# Altium project BridgeBoard.PrjPcb
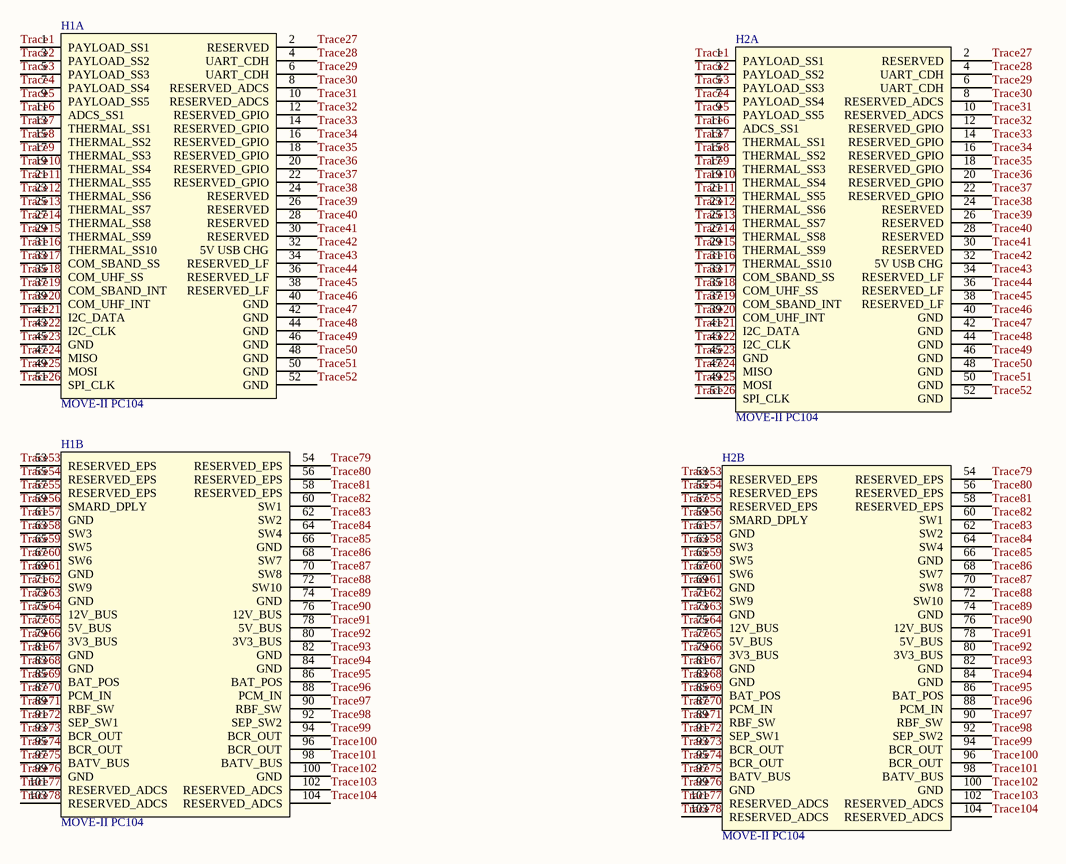
[diagram p0: BridgeBoard.SchDoc]
1 sheet, 2 parts. Net scope: global (net labels, ports and power ports of the same name join across sheets).
Board file: BridgeBoard.PcbDoc

## Sheet BridgeBoard.SchDoc
size A4

### Parts
H1  MOVE-II PC104  [PC104]  (parts A,B of 2)
H2  MOVE-II PC104  [PC104]  (parts A,B of 2)

### Nets
Trace1: H1.1(PAYLOAD_SS1) H2.1(PAYLOAD_SS1)
Trace2: H1.3(PAYLOAD_SS2) H2.3(PAYLOAD_SS2)
Trace3: H1.5(PAYLOAD_SS3) H2.5(PAYLOAD_SS3)
Trace4: H1.7(PAYLOAD_SS4) H2.7(PAYLOAD_SS4)
Trace5: H1.9(PAYLOAD_SS5) H2.9(PAYLOAD_SS5)
Trace6: H1.11(ADCS_SS1) H2.11(ADCS_SS1)
Trace7: H1.13(THERMAL_SS1) H2.13(THERMAL_SS1)
Trace8: H1.15(THERMAL_SS2) H2.15(THERMAL_SS2)
Trace9: H1.17(THERMAL_SS3) H2.17(THERMAL_SS3)
Trace10: H1.19(THERMAL_SS4) H2.19(THERMAL_SS4)
Trace11: H1.21(THERMAL_SS5) H2.21(THERMAL_SS5)
Trace12: H1.23(THERMAL_SS6) H2.23(THERMAL_SS6)
Trace13: H1.25(THERMAL_SS7) H2.25(THERMAL_SS7)
Trace14: H1.27(THERMAL_SS8) H2.27(THERMAL_SS8)
Trace15: H1.29(THERMAL_SS9) H2.29(THERMAL_SS9)
Trace16: H1.31(THERMAL_SS10) H2.31(THERMAL_SS10)
Trace17: H1.33(COM_SBAND_SS) H2.33(COM_SBAND_SS)
Trace18: H1.35(COM_UHF_SS) H2.35(COM_UHF_SS)
Trace19: H1.37(COM_SBAND_INT) H2.37(COM_SBAND_INT)
Trace20: H1.39(COM_UHF_INT) H2.39(COM_UHF_INT)
Trace21: H1.41(I2C_DATA) H2.41(I2C_DATA)
Trace22: H1.43(I2C_CLK) H2.43(I2C_CLK)
Trace23: H1.45(GND) H2.45(GND)
Trace24: H1.47(MISO) H2.47(MISO)
Trace25: H1.49(MOSI) H2.49(MOSI)
Trace26: H1.51(SPI_CLK) H2.51(SPI_CLK)
Trace27: H1.2(RESERVED) H2.2(RESERVED)
Trace28: H1.4(UART_CDH) H2.4(UART_CDH)
Trace29: H1.6(UART_CDH) H2.6(UART_CDH)
Trace30: H1.8(RESERVED_ADCS) H2.8(RESERVED_ADCS)
Trace31: H1.10(RESERVED_ADCS) H2.10(RESERVED_ADCS)
Trace32: H1.12(RESERVED_GPIO) H2.12(RESERVED_GPIO)
Trace33: H1.14(RESERVED_GPIO) H2.14(RESERVED_GPIO)
Trace34: H1.16(RESERVED_GPIO) H2.16(RESERVED_GPIO)
Trace35: H1.18(RESERVED_GPIO) H2.18(RESERVED_GPIO)
Trace36: H1.20(RESERVED_GPIO) H2.20(RESERVED_GPIO)
Trace37: H1.22(RESERVED_GPIO) H2.22(RESERVED_GPIO)
Trace38: H1.24(RESERVED) H2.24(RESERVED)
Trace39: H1.26(RESERVED) H2.26(RESERVED)
Trace40: H1.28(RESERVED) H2.28(RESERVED)
Trace41: H1.30(RESERVED) H2.30(RESERVED)
Trace42: H1.32(5V_USB_CHG) H2.32(5V_USB_CHG)
Trace43: H1.34(RESERVED_LF) H2.34(RESERVED_LF)
Trace44: H1.36(RESERVED_LF) H2.36(RESERVED_LF)
Trace45: H1.38(RESERVED_LF) H2.38(RESERVED_LF)
Trace46: H1.40(GND) H2.40(GND)
Trace47: H1.42(GND) H2.42(GND)
Trace48: H1.44(GND) H2.44(GND)
Trace49: H1.46(GND) H2.46(GND)
Trace50: H1.48(GND) H2.48(GND)
Trace51: H1.50(GND) H2.50(GND)
Trace52: H1.52(GND) H2.52(GND)
Trace53: H1.53(RESERVED_EPS) H2.53(RESERVED_EPS)
Trace54: H1.55(RESERVED_EPS) H2.55(RESERVED_EPS)
Trace55: H1.57(RESERVED_EPS) H2.57(RESERVED_EPS)
Trace56: H1.59(SMARD_DPLY) H2.59(SMARD_DPLY)
Trace57: H1.61(GND) H2.61(GND)
Trace58: H1.63(SW3) H2.63(SW3)
Trace59: H1.65(SW5) H2.65(SW5)
Trace60: H1.67(SW6) H2.67(SW6)
Trace61: H1.69(GND) H2.69(GND)
Trace62: H1.71(SW9) H2.71(SW9)
Trace63: H1.73(GND) H2.73(GND)
Trace64: H1.75(12V_BUS) H2.75(12V_BUS)
Trace65: H1.77(5V_BUS) H2.77(5V_BUS)
Trace66: H1.79(3V3_BUS) H2.79(3V3_BUS)
Trace67: H1.81(GND) H2.81(GND)
Trace68: H1.83(GND) H2.83(GND)
Trace69: H1.85(BAT_POS) H2.85(BAT_POS)
Trace70: H1.87(PCM_IN) H2.87(PCM_IN)
Trace71: H1.89(RBF_SW) H2.89(RBF_SW)
Trace72: H1.91(SEP_SW1) H2.91(SEP_SW1)
Trace73: H1.93(BCR_OUT) H2.93(BCR_OUT)
Trace74: H1.95(BCR_OUT) H2.95(BCR_OUT)
Trace75: H1.97(BATV_BUS) H2.97(BATV_BUS)
Trace76: H1.99(GND) H2.99(GND)
Trace77: H1.101(RESERVED_ADCS) H2.101(RESERVED_ADCS)
Trace78: H1.103(RESERVED_ADCS) H2.103(RESERVED_ADCS)
Trace79: H1.54(RESERVED_EPS) H2.54(RESERVED_EPS)
Trace80: H1.56(RESERVED_EPS) H2.56(RESERVED_EPS)
Trace81: H1.58(RESERVED_EPS) H2.58(RESERVED_EPS)
Trace82: H1.60(SW1) H2.60(SW1)
Trace83: H1.62(SW2) H2.62(SW2)
Trace84: H1.64(SW4) H2.64(SW4)
Trace85: H1.66(GND) H2.66(GND)
Trace86: H1.68(SW7) H2.68(SW7)
Trace87: H1.70(SW8) H2.70(SW8)
Trace88: H1.72(SW10) H2.72(SW10)
Trace89: H1.74(GND) H2.74(GND)
Trace90: H1.76(12V_BUS) H2.76(12V_BUS)
Trace91: H1.78(5V_BUS) H2.78(5V_BUS)
Trace92: H1.80(3V3_BUS) H2.80(3V3_BUS)
Trace93: H1.82(GND) H2.82(GND)
Trace94: H1.84(GND) H2.84(GND)
Trace95: H1.86(BAT_POS) H2.86(BAT_POS)
Trace96: H1.88(PCM_IN) H2.88(PCM_IN)
Trace97: H1.90(RBF_SW) H2.90(RBF_SW)
Trace98: H1.92(SEP_SW2) H2.92(SEP_SW2)
Trace99: H1.94(BCR_OUT) H2.94(BCR_OUT)
Trace100: H1.96(BCR_OUT) H2.96(BCR_OUT)
Trace101: H1.98(BATV_BUS) H2.98(BATV_BUS)
Trace102: H1.100(GND) H2.100(GND)
Trace103: H1.102(RESERVED_ADCS) H2.102(RESERVED_ADCS)
Trace104: H1.104(RESERVED_ADCS) H2.104(RESERVED_ADCS)